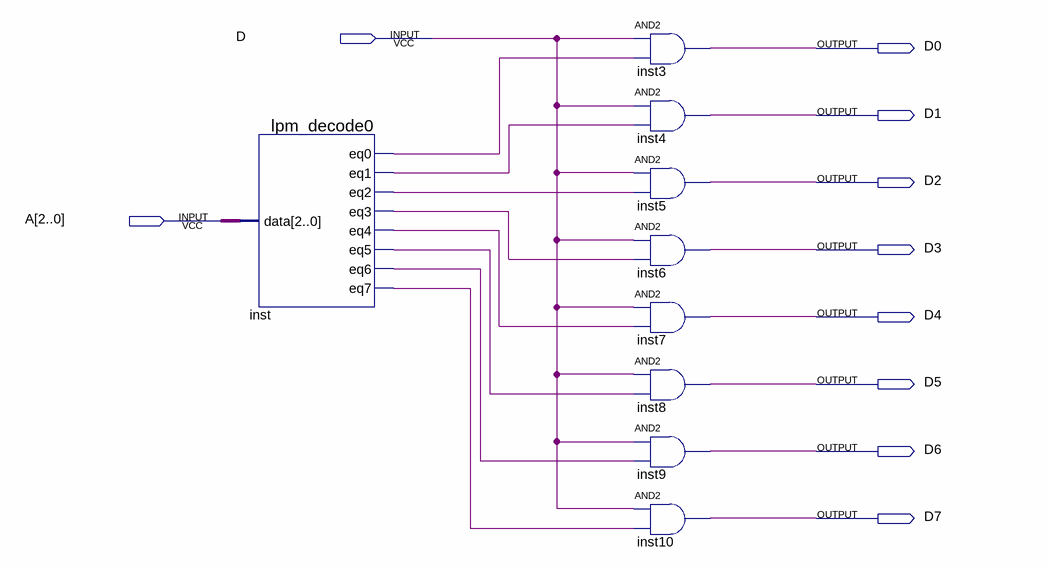
[diagram p0: schematic sheet]
// Quartus schematic dmx_3x7.bdf as structural Verilog: 9 symbols, 10 pins
module dmx_3x7 (
  input  D,
  input  [2:0] A,
  output D0,
  output D1,
  output D2,
  output D3,
  output D4,
  output D5,
  output D6,
  output D7
);

  wire inst_eq0, inst_eq1, inst_eq2, inst_eq3, inst_eq4, inst_eq5, inst_eq6, inst_eq7;

  lpm_decode0 inst (
    .data(A), .eq0(inst_eq0), .eq1(inst_eq1), .eq2(inst_eq2), .eq3(inst_eq3), .eq4(inst_eq4), .eq5(inst_eq5),
    .eq6(inst_eq6), .eq7(inst_eq7));
  and inst3 (D0, D, inst_eq0);
  and inst4 (D1, D, inst_eq1);
  and inst5 (D2, D, inst_eq2);
  and inst6 (D3, D, inst_eq3);
  and inst7 (D4, D, inst_eq4);
  and inst8 (D5, D, inst_eq5);
  and inst9 (D6, D, inst_eq6);
  and inst10 (D7, D, inst_eq7);
endmodule
